# EAGLE design Z05_C8V_A_01 (EAGLE 6.3)
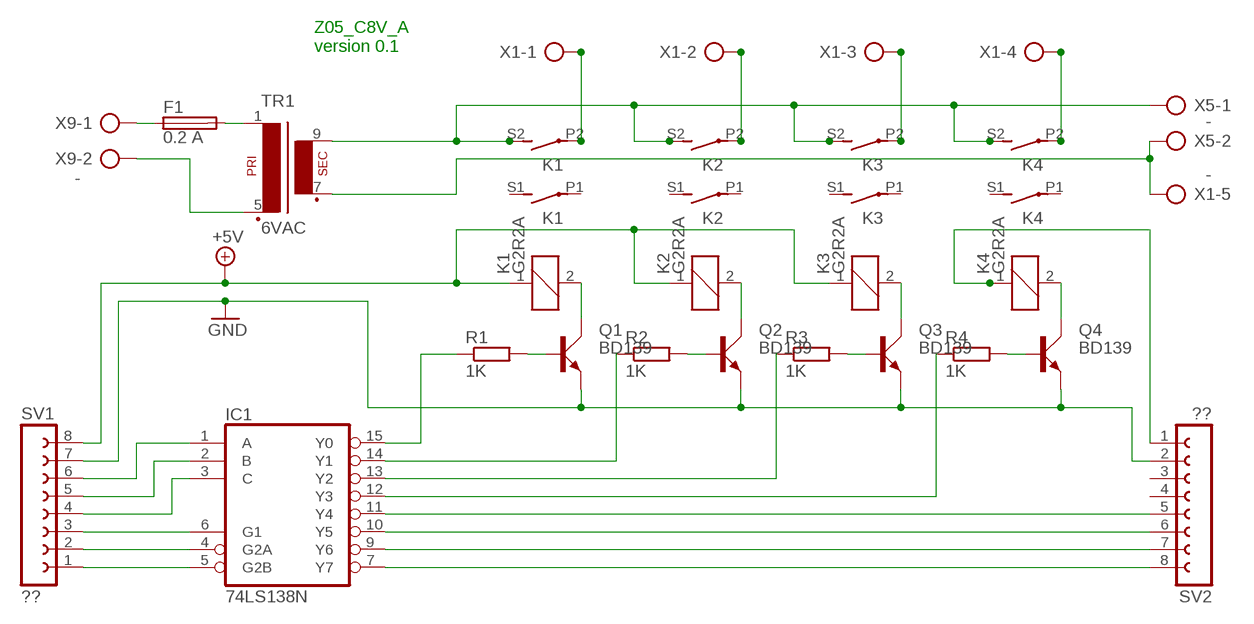
[diagram p0: schematic, sheet 1]

## Parts
F1  0.2 A  GSH15  [GSH15]
IC1  74LS138N  [DIL16]
K1  G2R2A  [G2R2A]
K2  G2R2A  [G2R2A]
K3  G2R2A  [G2R2A]
K4  G2R2A  [G2R2A]
Q1  BD139  [TO126AV]
Q2  BD139  [TO126AV]
Q3  BD139  [TO126AV]
Q4  BD139  [TO126AV]
R1  1K  R-EU_0204/7  [0204/7]
R2  1K  R-EU_0204/7  [0204/7]
R3  1K  R-EU_0204/7  [0204/7]
R4  1K  R-EU_0204/7  [0204/7]
SV1  ??  FE08W  [FE08W]
SV2  ??  FE08W  [FE08W]
TR1  6VAC  EI42-1  [EI42-1]
X1  -  AK300/5  [AK300/5]
X5  -  AK300/2  [AK300/2]
X9  -  AK300/2  [AK300/2]

## Nets
+5V: K1.1 K2.1 K3.1 SV1.8
GND: Q1.E Q2.E Q3.E Q4.E SV1.7 SV2.2
N$1: K1.S2(3:S) K2.S2(3:S) K3.S2(3:S) K4.S2(3:S) TR1.9(S4) X5.1
N$2: TR1.7(S3) X1.5 X5.2
N$3: Q1.B R1.2
N$4: IC1.15(Y0) R1.1
N$5: K1.2 Q1.C
N$6: K4.1 SV2.1
N$7: IC1.11(Y4) SV2.5
N$8: Q2.B R2.2
N$9: K2.2 Q2.C
N$10: IC1.10(Y5) SV2.6
N$11: IC1.9(Y6) SV2.7
N$12: Q3.B R3.2
N$13: K3.2 Q3.C
N$14: IC1.7(Y7) SV2.8
N$16: Q4.B R4.2
N$17: K4.2 Q4.C
N$27: IC1.14(Y1) R2.1
N$30: IC1.13(Y2) R3.1
N$31: IC1.12(Y3) R4.1
N$38: K1.P2(3:P) K2.P2(3:P) K3.P2(3:P) K4.P2(3:P) X1.1 X1.2 X1.3 X1.4
N$40: F1.1 X9.1
N$41: F1.2 TR1.1
N$42: IC1.1(A) SV1.6
N$43: IC1.2(B) SV1.5
N$44: IC1.3(C) SV1.4
N$45: IC1.6(G1) SV1.3
N$46: IC1.4(G2A) SV1.2
N$47: IC1.5(G2B) SV1.1
N$48: TR1.5(P2) X9.2
Unconnected: K1.P1(2:P) K1.S1(2:S) K2.P1(2:P) K2.S1(2:S) K3.P1(2:P) K3.S1(2:S) K4.P1(2:P) K4.S1(2:S) SV2.3 SV2.4

## Notes on the sheet
- Z05_C8V_A
  version 0.1

## Power pins joined to a net without a drawn wire
GND: IC1.8(GND)
VCC: IC1.16(VCC)

## Library data of the parts
F1 = fuse:GSH15: FUSE HOLDER grid 15mm, 19649 Wickmann; MPN: 64900001039; OC_FARNELL: 1271673; OC_NEWARK: 02P0318
IC1 = 74xx-eu:74*138: 3-line to 8-line DECODER/DEMULTIPLEXER
K1-K4 = relay:G2R2A: RELAY 2 x norm. open, Omron; MPN: G2R-2A-DC24; OC_FARNELL: 6985269; OC_NEWARK: 36M5257
Q1-Q4 = transistor-power:BD139: NPN TRANSISTOR
R1-R4 = rcl:R-EU_: RESISTOR, European symbol
SV1 SV2 = con-lsta:FE08W: FEMALE HEADER; OC_FARNELL: unknown; OC_NEWARK: unknown
TR1 = trafo:EI42-1: TRANSFORMER 1 primary winding, 1 secondary winding ERA
X1 = con-ptr500:AK300/5: CONNECTOR; OC_FARNELL: unknown; OC_NEWARK: unknown
X5 X9 = con-ptr500:AK300/2: CONNECTOR; OC_FARNELL: unknown; OC_NEWARK: unknown

## Board
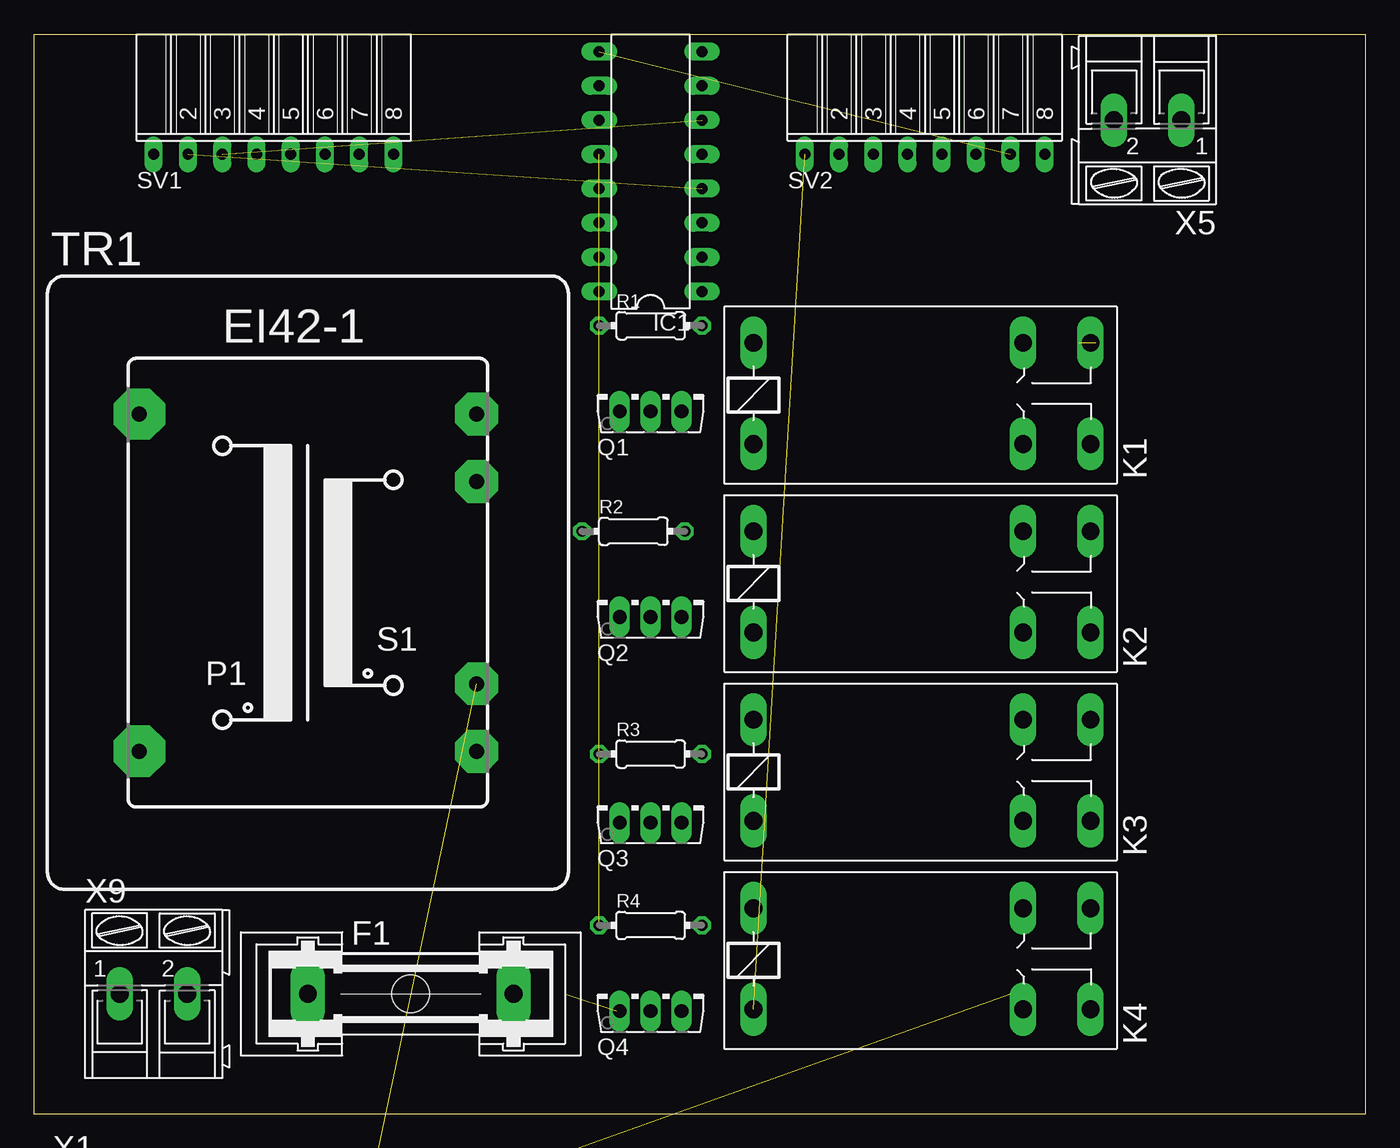
[diagram p1: board, top side]
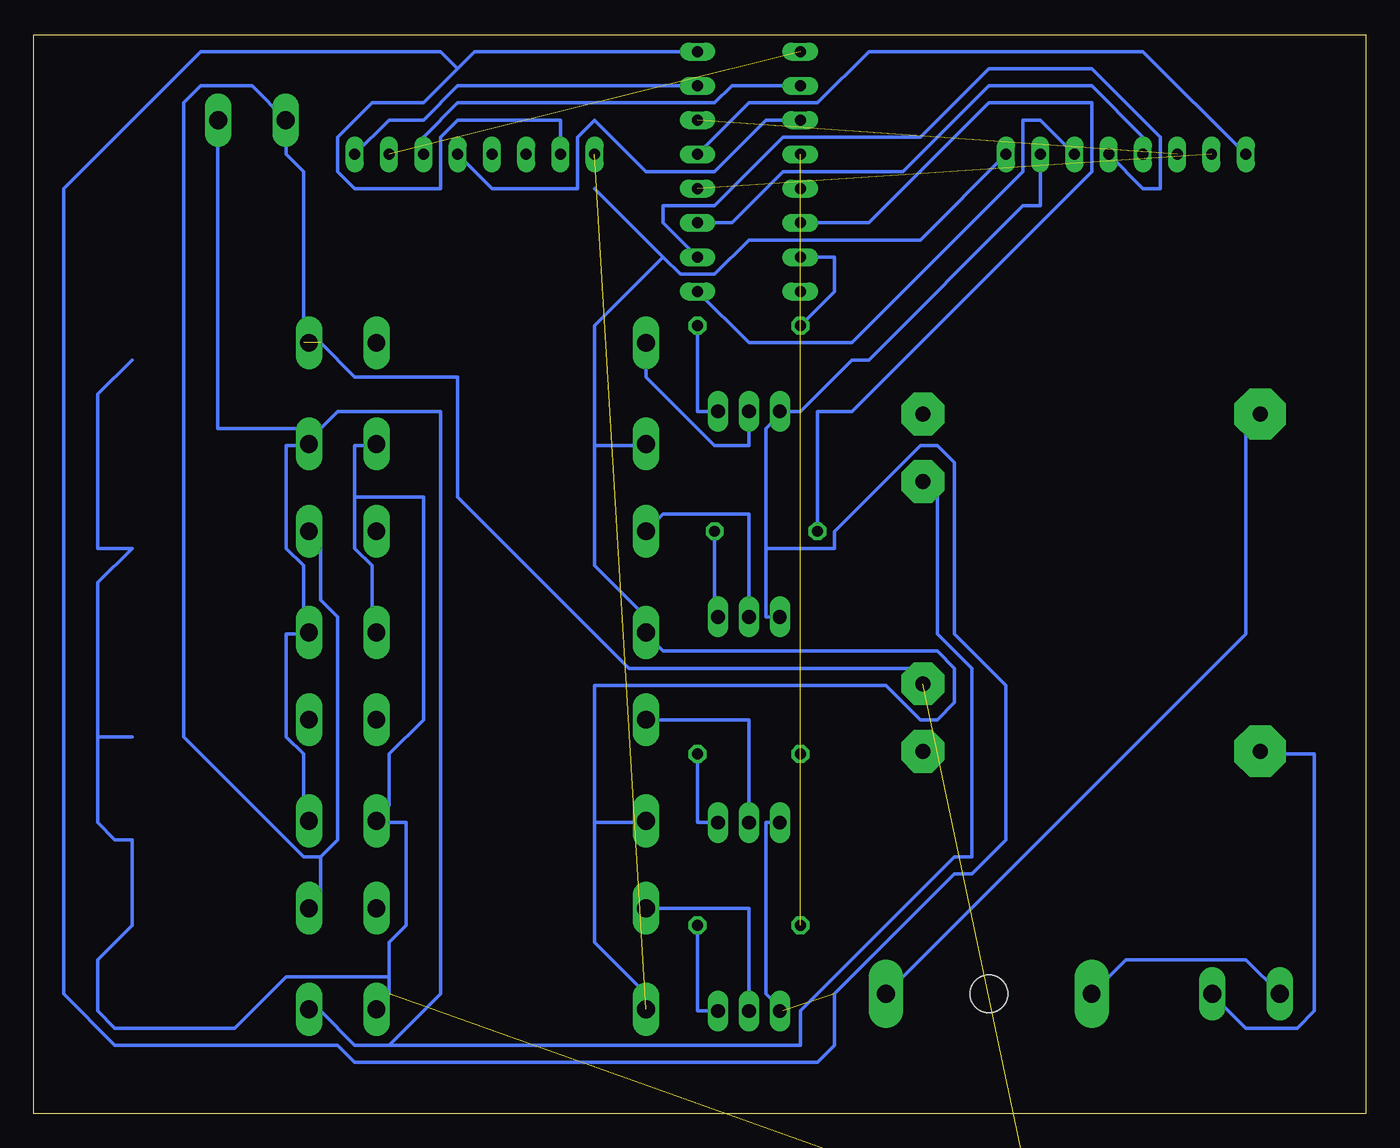
[diagram p2: board, bottom side, seen from below]

Size 98.73 x 80 mm. Coordinates in mm from the lower left corner, seen from the top.
Outline: 0,0 98.73,0 98.73,80 0,80 0,0
Copper layers (1*16): Top 0mil / dielectric 1.5mm / Bottom 0.035mm
Design rules "default *": minimum track width 10mil, minimum drill 24mil, track to track 8mil, track to pad 8mil, pad to pad 8mil, via to via 8mil, smd to smd 8mil, copper to edge 40mil, drill to drill 8mil, minimum pad ring 10mil, minimum via ring 8mil, stop-mask expansion 4mil, vias tented up to drill 0mil, thermal gap 10mil

### Footprints (pad centres in the part's own frame; a part is rotated, then mirrored left to right if it is on the bottom)
GSH15 = drill 1.321 pad 2.54 long: 1 -7.62,0; 2 7.62,0 | hole 2.794: 0,0
DIL16 = drill 0.813 long: 1 -8.89,-3.81; 2 -6.35,-3.81; 3 -3.81,-3.81; 4 -1.27,-3.81; 5 1.27,-3.81; 6 3.81,-3.81; 7 6.35,-3.81; 8 8.89,-3.81; 9 8.89,3.81; 10 6.35,3.81; 11 3.81,3.81; 12 1.27,3.81; 13 -1.27,3.81; 14 -3.81,3.81; 15 -6.35,3.81; 16 -8.89,3.81
G2R2A = drill 1.321 long: 1 -2.54,-3.683; 2 -2.54,3.81; P1 17.45,3.81; P2 17.45,-3.683; S1 22.454,3.81; S2 22.454,-3.683
TO126AV = drill 1.016 long: B 2.286,-1.27; C 0,-1.27; E -2.286,-1.27
0204/7 = drill 0.813 octagon: 1 -3.81,0; 2 3.81,0
FE08W = drill 0.813 long: 1 -8.89,0; 2 -6.35,0; 3 -3.81,0; 4 -1.27,0; 5 1.27,0; 6 3.81,0; 7 6.35,0; 8 8.89,0
EI42-1 = drill 1.118 pad 3.81 octagon: 1 -12.497,12.497; 5 -12.497,-12.497 | drill 1.118 pad 3.175 octagon: 6 12.497,-12.497; 7 12.497,-7.493; 9 12.497,7.493; 10 12.497,12.497
AK300/5 = drill 1.321 long: 1 -10.008,0; 2 -5.004,0; 3 0,0; 4 5.004,0; 5 10.008,0
AK300/2 = drill 1.321 long: 1 -2.515,0; 2 2.489,0

### Placement (x,y rotation side)
F1  27.94,8.89 0 top
IC1  45.72,69.85 90 top
K1  55.88,53.34 0 top
K2  55.88,39.37 0 top
K3  55.88,25.4 0 top
K4  55.88,11.43 0 top
Q1  45.72,53.34 0 top
Q2  45.72,38.1 0 top
Q3  45.72,22.86 0 top
Q4  45.72,8.89 0 top
R1  45.72,58.42 0 top
R2  44.45,43.18 0 top
R3  45.72,26.67 0 top
R4  45.72,13.97 0 top
SV1  17.78,71.12 0 top
SV2  66.04,71.12 0 top
TR1  20.32,39.37 0 top
X1  13.97,-10.16 0 top  (outside the outline)
X5  82.55,73.66 180 top
X9  8.89,8.89 0 top

### Tracks (layer width: path | path; a pad name or v marks a point on that pad's centre or on a via)
+5V
  Bottom 0.254: SV1.8 33.02,64.77 45.72,64.77 48.26,62.23 50.8,62.23 52.07,63.5 | 57.15,68.58 52.07,63.5 | 53.34,8.89 57.15,12.7 57.15,21.59 | 57.15,21.59 53.34,21.59 K3.1 | 57.15,49.53 57.15,40.64 53.34,36.83 K2.1 53.34,35.56 52.07,34.29 31.75,34.29 30.48,33.02 30.48,30.48 31.75,29.21 33.02,29.21 35.56,31.75 57.15,31.75 57.15,21.59 | 57.15,49.53 53.34,49.53 K1.1 | 52.07,63.5 57.15,58.42 57.15,49.53
GND  (1 unrouted)
  Bottom 0.254: SV2.2 59.69,73.66 67.31,73.66 68.58,72.39 68.58,68.58 74.93,68.58 76.2,69.85 76.2,72.39 73.66,74.93 69.85,74.93 67.31,77.47 | 67.31,77.47 66.04,78.74 IC1.8 | 43.18,52.07 44.45,50.8 44.45,41.91 | 44.45,41.91 44.45,36.83 Q2.E 43.18,36.83 | SV1.7 24.13,67.31 25.4,67.31 36.83,55.88 38.1,55.88 41.91,52.07 43.18,52.07 | 43.18,52.07 Q1.E | 67.31,77.47 68.58,78.74 86.36,78.74 96.52,68.58 96.52,8.89 92.71,5.08 76.2,5.08 74.93,3.81 40.64,3.81 39.37,5.08 39.37,8.89 30.48,17.78 29.21,17.78 26.67,20.32 26.67,31.75 30.48,35.56 30.48,48.26 31.75,49.53 33.02,49.53 39.37,43.18 39.37,41.91 44.45,41.91 | Q4.E 43.18,7.62 44.45,8.89 44.45,21.59 Q3.E 43.18,21.59
N$1
  Bottom 0.254: K3.S2 78.74,22.86 78.74,26.67 80.01,27.94 80.01,35.56 78.74,35.56 K2.S2 78.74,36.83 78.74,40.64 80.01,41.91 80.01,49.53 78.74,49.53 K1.S2 | 72.39,5.08 74.93,5.08 77.47,7.62 K4.S2 | 72.39,5.08 68.58,8.89 68.58,52.07 76.2,52.07 77.47,50.8 K1.S2 | X5.1 85.09,73.66 85.09,50.8 78.74,50.8 K1.S2 | 72.39,5.08 41.91,5.08 41.91,7.62 30.48,19.05 29.21,19.05 29.21,33.02 31.75,35.56 31.75,45.72 TR1.9
N$2  (2 unrouted)
  Bottom 0.254: 77.47,19.05 77.47,15.24 | 77.47,19.05 76.2,20.32 76.2,29.21 76.2,36.83 77.47,38.1 77.47,43.18 | 78.74,57.15 78.74,69.85 80.01,71.12 80.01,73.66 | 77.47,57.15 74.93,54.61 67.31,54.61 67.31,45.72 54.61,33.02 33.02,33.02 TR1.7 | 77.47,19.05 78.74,19.05 87.63,27.94 87.63,74.93 86.36,76.2 82.55,76.2 80.01,73.66 | 80.01,73.66 X5.2
N$3
  Bottom 0.254: R1.2 49.53,52.07 Q1.B
N$4
  Bottom 0.254: R1.1 39.37,60.96 39.37,63.5 IC1.15
N$5
  Bottom 0.254: Q1.C 45.72,49.53 48.26,49.53 53.34,54.61 K1.2
N$6  (1 unrouted)
N$7
  Bottom 0.254: IC1.11 44.45,73.66 48.26,69.85 53.34,69.85 57.15,73.66 58.42,72.39 58.42,68.58 64.77,68.58 SV2.5
N$8
  Bottom 0.254: R2.2 48.26,36.83 Q2.B
N$9
  Bottom 0.254: Q2.C 45.72,44.45 52.07,44.45 K2.2
N$10
  Bottom 0.254: IC1.10 46.99,76.2 48.26,74.93 67.31,74.93 69.85,72.39 SV2.6
N$11  (1 unrouted)
N$12
  Bottom 0.254: R3.2 49.53,21.59 Q3.B
N$13
  Bottom 0.254: Q3.C 45.72,29.21 K3.2
N$14
  Bottom 0.254: IC1.7 67.31,76.2 69.85,73.66 72.39,73.66 SV2.8
N$16
  Bottom 0.254: R4.2 49.53,7.62 Q4.B
N$17
  Bottom 0.254: Q4.C 45.72,15.24 K4.2
N$27
  Bottom 0.254: R2.1 40.64,52.07 38.1,52.07 20.32,69.85 20.32,74.93 27.94,74.93 36.83,66.04 IC1.14
N$30  (1 unrouted)
N$31  (1 unrouted)
N$38  (4 unrouted)
  Bottom 0.254: 93.98,27.94 93.98,21.59 92.71,20.32 91.44,20.32 91.44,13.97 93.98,11.43 93.98,7.62 92.71,6.35 83.82,6.35 80.01,10.16 72.39,10.16 | 91.44,27.94 93.98,27.94 | 93.98,27.94 93.98,39.37 91.44,41.91 93.98,41.91 93.98,53.34 91.44,55.88 | 72.39,10.16 72.39,12.7 71.12,13.97 71.12,21.59 72.39,21.59 K3.P2 72.39,22.86 72.39,26.67 69.85,29.21 69.85,45.72 74.93,45.72 | 72.39,10.16 72.39,8.89 K4.P2 | 74.93,45.72 74.93,49.53 73.66,49.53 K1.P2 | 74.93,45.72 74.93,41.91 73.66,40.64 73.66,36.83 K2.P2
N$40
  Bottom 0.254: F1.1 17.78,11.43 8.89,11.43 6.35,8.89 X9.1
N$41
  Bottom 0.254: F1.2 8.89,35.56 8.89,50.8 TR1.1
N$42
  Bottom 0.254: IC1.1 45.72,57.15 38.1,57.15 25.4,69.85 25.4,73.66 24.13,73.66 SV1.6
N$43
  Bottom 0.254: IC1.2 52.07,66.04 52.07,67.31 48.26,67.31 43.18,72.39 33.02,72.39 27.94,77.47 20.32,77.47 15.24,72.39 15.24,68.58 16.51,68.58 SV1.5
N$44
  Bottom 0.254: IC1.3 46.99,66.04 43.18,69.85 34.29,69.85 27.94,76.2 20.32,76.2 16.51,72.39 SV1.4
N$45  (1 unrouted)
N$46  (1 unrouted)
N$47
  Bottom 0.254: SV1.1 16.51,78.74 36.83,78.74 40.64,74.93 45.72,74.93 IC1.5
N$48
  Bottom 0.254: X9.2 11.43,8.89 8.89,6.35 5.08,6.35 3.81,7.62 3.81,26.67 7.62,26.67 TR1.5